# EAGLE design 09-09e (EAGLE 6.6.0)

## Sheet 1 of 2
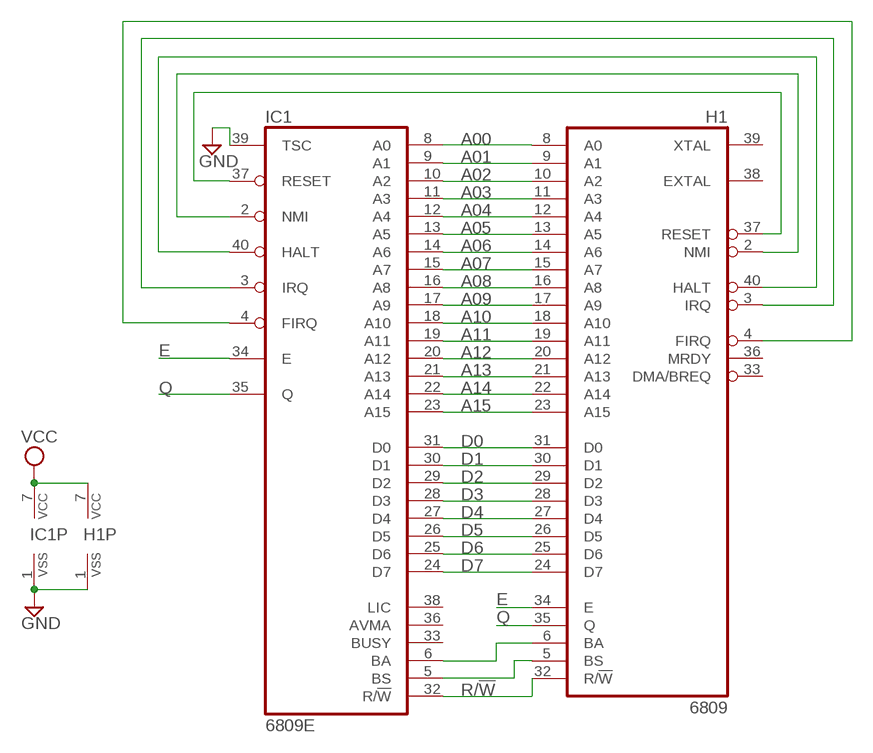
[diagram p0: schematic, sheet 1]

### Parts
H1  6809  [DIL40]
IC1  6809E  [DIL40]

### Nets
A00: H1.8(A0) IC1.8(A0)
A01: H1.9(A1) IC1.9(A1)
A02: H1.10(A2) IC1.10(A2)
A03: H1.11(A3) IC1.11(A3)
A04: H1.12(A4) IC1.12(A4)
A05: H1.13(A5) IC1.13(A5)
A06: H1.14(A6) IC1.14(A6)
A07: H1.15(A7) IC1.15(A7)
A08: H1.16(A8) IC1.16(A8)
A09: H1.17(A9) IC1.17(A9)
A10: H1.18(A10) IC1.18(A10)
A11: H1.19(A11) IC1.19(A11)
A12: H1.20(A12) IC1.20(A12)
A13: H1.21(A13) IC1.21(A13)
A14: H1.22(A14) IC1.22(A14)
A15: H1.23(A15) IC1.23(A15)
D0: H1.31(D0) IC1.31(D0)
D1: H1.30(D1) IC1.30(D1)
D2: H1.29(D2) IC1.29(D2)
D3: H1.28(D3) IC1.28(D3)
D4: H1.27(D4) IC1.27(D4)
D5: H1.26(D5) IC1.26(D5)
D6: H1.25(D6) IC1.25(D6)
D7: H1.24(D7) IC1.24(D7)
E: H1.34(E) IC1.34(E) ; also sheet 2
GND [Power]: H1.1(VSS) IC1.1(VSS) IC1.39(TSC) ; also sheet 2
N$1: H1.5(BS) IC1.5(BS)
N$4: H1.6(BA) IC1.6(BA)
N$5: H1.37(RESET) IC1.37(RESET)
N$6: H1.2(NMI) IC1.2(NMI)
N$8: H1.40(HALT) IC1.40(HALT)
N$9: H1.3(IRQ) IC1.3(IRQ)
N$10: H1.4(FIRQ) IC1.4(FIRQ)
Q: H1.35(Q) IC1.35(Q) ; also sheet 2
R/!W: H1.32(R/!W) IC1.32(R/!W)
VCC [Power]: H1.7(VCC) IC1.7(VCC) ; also sheet 2
Unconnected: H1.33(DMA/BREQ) H1.36(MRDY) H1.38(EXTAL) H1.39(XTAL) IC1.33(BUSY) IC1.36(AVMA) IC1.38(LIC)

## Sheet 2 of 2
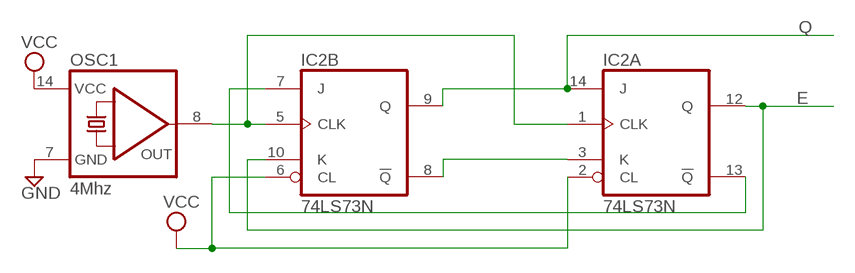
[diagram p1: schematic, sheet 2]

### Parts
IC2  74LS73N  [DIL14]
OSC1  4Mhz  QG5860  [DIL14S]

### Nets
E: IC2.10(B:K) IC2.12(A:Q) ; also sheet 1
GND [Power]: OSC1.7(GND) ; also sheet 1
N$2: IC2.1(A:CLK) IC2.5(B:CLK) OSC1.8(OUT)
N$3: IC2.3(A:K) IC2.8(B:!Q)
N$7: IC2.7(B:J) IC2.13(A:!Q)
Q: IC2.9(B:Q) IC2.14(A:J) ; also sheet 1
VCC [Power]: IC2.2(A:CL) IC2.6(B:CL) OSC1.14(VCC) ; also sheet 1

## Power pins joined to a net without a drawn wire
GND: IC2.11(P:GND)
VCC: IC2.4(P:VCC)

## Library data of the parts
H1 = micro-motorola:6809: MICROCONTROLLER/MEMORY DEVICE; MF: NTE ELECTRONICS; MPN: NTE6809; OC_FARNELL: 4530354; OC_NEWARK: 31C2459
IC1 = micro-motorola:6809E: MICROCONTROLLER/MEMORY DEVICE; MF: NTE ELECTRONICS; MPN: NTE6809E; OC_FARNELL: unknown; OC_NEWARK: 31C5318
IC2 = 74xx-us:74*73: Dual J-K FLIP FLOP, clear
OSC1 = crystal:QG5860: CRYSTAL RESONATOR; OC_FARNELL: unknown; OC_NEWARK: unknown

## Net classes
1 Power: width 0.508 mm, drill 0.254 mm, clearance 0.254 mm

## Board
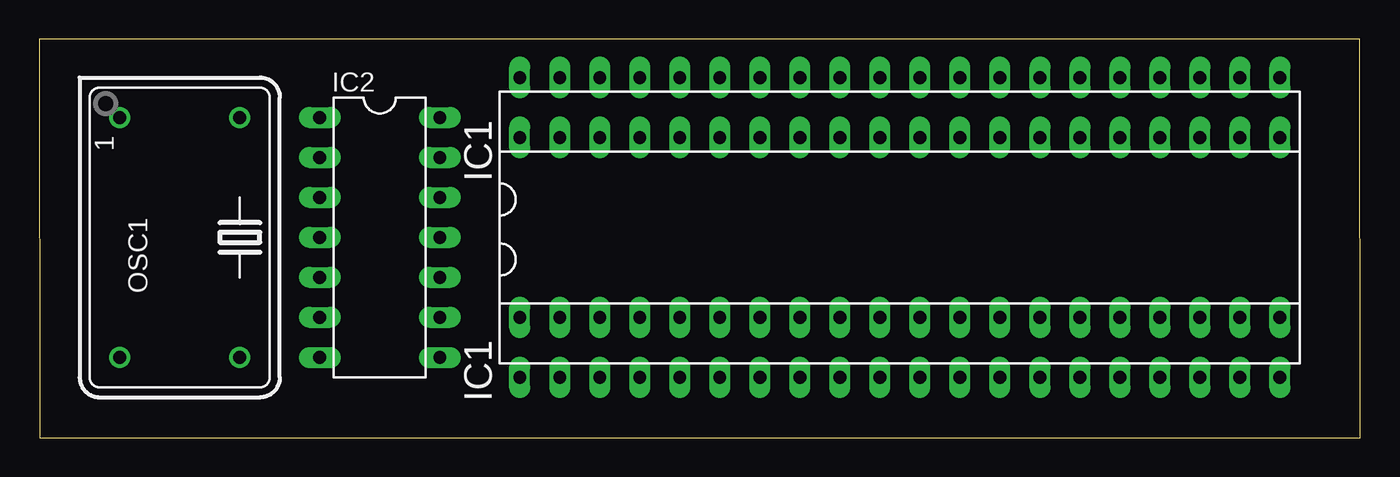
[diagram p2: board, top side]
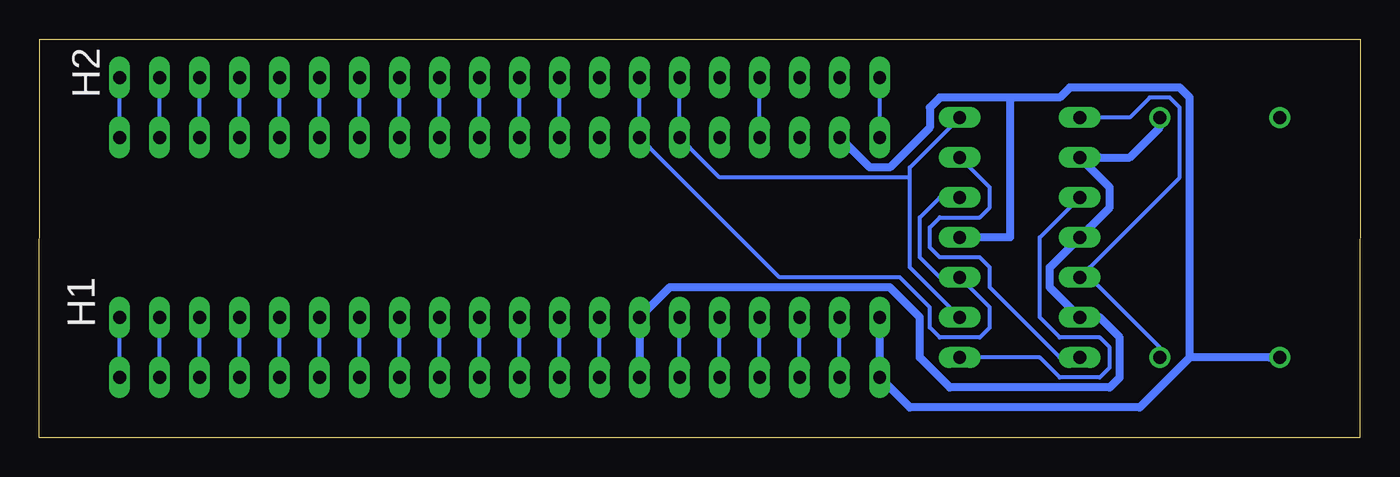
[diagram p3: board, bottom side, seen from below]

Size 83.85 x 25.3 mm. Coordinates in mm from the lower left corner, seen from the top.
Outline: 0.03,0 83.85,0 83.83,25.3 0,25.3 0.03,0
Copper layers (1*16): Top 0.035mm / dielectric 1.5mm / Bottom 0.035mm
Design rules "olimex10mil": minimum track width 10mil, minimum drill 24mil, track to track 10mil, track to pad 10mil, pad to pad 10mil, via to via 10mil, smd to smd 10mil, copper to edge 40mil, drill to drill 10mil, minimum pad ring 10mil, minimum via ring 8mil, stop-mask expansion 0mil, vias tented up to drill 0mil, thermal gap 10mil

### Footprints (pad centres in the part's own frame; a part is rotated, then mirrored left to right if it is on the bottom)
DIL40 = drill 0.813 long: 1 -24.13,-7.62; 2 -21.59,-7.62; 3 -19.05,-7.62; 4 -16.51,-7.62; 5 -13.97,-7.62; 6 -11.43,-7.62; 7 -8.89,-7.62; 8 -6.35,-7.62; 9 -3.81,-7.62; 10 -1.27,-7.62; 11 1.27,-7.62; 12 3.81,-7.62; 13 6.35,-7.62; 14 8.89,-7.62; 15 11.43,-7.62; 16 13.97,-7.62; 17 16.51,-7.62; 18 19.05,-7.62; 19 21.59,-7.62; 20 24.13,-7.62; 21 24.13,7.62; 22 21.59,7.62; 23 19.05,7.62; 24 16.51,7.62; 25 13.97,7.62; 26 11.43,7.62; 27 8.89,7.62; 28 6.35,7.62; 29 3.81,7.62; 30 1.27,7.62; 31 -1.27,7.62; 32 -3.81,7.62; 33 -6.35,7.62; 34 -8.89,7.62; 35 -11.43,7.62; 36 -13.97,7.62; 37 -16.51,7.62; 38 -19.05,7.62; 39 -21.59,7.62; 40 -24.13,7.62
DIL14 = drill 0.813 long: 1 -7.62,-3.81; 2 -5.08,-3.81; 3 -2.54,-3.81; 4 0,-3.81; 5 2.54,-3.81; 6 5.08,-3.81; 7 7.62,-3.81; 8 7.62,3.81; 9 5.08,3.81; 10 2.54,3.81; 11 0,3.81; 12 -2.54,3.81; 13 -5.08,3.81; 14 -7.62,3.81
DIL14S = drill 0.813: 1 -7.62,-3.81; 7 7.62,-3.81; 8 7.62,3.81; 14 -7.62,3.81

### Placement (x,y rotation side)
H1  54.63,15.25 0 top
IC1  54.63,11.44 0 top
IC2  21.61,12.71 270 top
OSC1  8.91,12.71 270 top

### Tracks (layer width: path | path; a pad name or v marks a point on that pad's centre or on a via)
A00
  Bottom 0.254: IC1.8 48.28,5.09 48.28,6.36 H1.8
A01
  Bottom 0.254: IC1.9 50.82,5.09 50.82,6.36 H1.9
A02
  Bottom 0.254: IC1.10 53.36,5.09 53.36,6.36 H1.10
A03
  Bottom 0.254: IC1.11 55.9,5.09 55.9,6.36 H1.11
A04
  Bottom 0.254: IC1.12 58.44,5.09 58.44,6.36 H1.12
A05
  Bottom 0.254: IC1.13 60.98,5.09 60.98,6.36 H1.13
A06
  Bottom 0.254: IC1.14 63.52,5.09 63.52,6.36 H1.14
A07
  Bottom 0.254: IC1.15 66.06,5.09 66.06,6.36 H1.15
A08
  Bottom 0.254: IC1.16 68.6,5.09 68.6,6.36 H1.16
A09
  Bottom 0.254: IC1.17 71.14,5.09 71.14,6.36 H1.17
A10
  Bottom 0.254: IC1.18 73.68,5.09 73.68,6.36 H1.18
A11
  Bottom 0.254: IC1.19 76.22,5.09 76.22,6.36 H1.19
A12
  Bottom 0.254: IC1.20 78.76,5.09 78.76,6.36 H1.20
A13
  Bottom 0.254: IC1.21 78.76,20.33 78.76,21.6 H1.21
A14
  Bottom 0.254: IC1.22 76.22,20.33 76.22,21.6 H1.22
A15
  Bottom 0.254: IC1.23 73.68,20.33 73.68,21.6 H1.23
D0
  Bottom 0.254: IC1.31 53.36,20.33 53.36,21.6 H1.31
D1
  Bottom 0.254: IC1.30 55.9,20.33 55.9,21.6 H1.30
D2
  Bottom 0.254: IC1.29 58.44,20.33 58.44,21.6 H1.29
D3
  Bottom 0.254: IC1.28 60.98,20.33 60.98,21.6 H1.28
D4
  Bottom 0.254: IC1.27 63.52,20.33 63.52,21.6 H1.27
D5
  Bottom 0.254: IC1.26 66.06,20.33 66.06,21.6 H1.26
D6
  Bottom 0.254: IC1.25 68.6,20.33 68.6,21.6 H1.25
D7
  Bottom 0.254: IC1.24 71.14,20.33 71.14,21.6 H1.24
E
  Bottom 0.254: H1.34 45.74,21.6 45.74,20.33 IC1.34 45.11,18.43 36.85,10.17 29.23,10.17 27.33,8.27 27.33,7 26.69,6.36 24.15,6.36 23.52,7 23.52,8.27 24.79,9.54 IC2.10 | IC2.10 26.69,10.17 | 26.69,10.17 27.96,11.44 27.96,13.98 26.69,15.25 IC2.12 | IC2.10 26.69,10.17
GND
  Bottom 0.508: 10.82,5.09 5.74,5.09 OSC1.7 | 10.82,5.09 13.99,1.92 28.6,1.92 29.87,3.19 IC1.1 30.5,5.09 30.5,6.36 H1.1 | 10.82,5.09 10.82,21.6 11.45,22.24 18.44,22.24 19.07,21.6 22.25,21.6 | 22.25,21.6 26.69,21.6 27.33,20.97 27.33,19.7 29.87,17.16 31.14,17.16 32.41,18.43 IC1.39 | 22.25,21.6 22.22,12.71 24.35,12.71 IC2.11
N$1
  Bottom 0.254: IC1.5 40.66,5.09 40.66,6.36 H1.5
N$2
  Bottom 0.254: OSC1.8 12.72,5.73 17.17,10.17 IC2.5 17.17,10.81 11.45,16.52 11.45,20.97 12.09,21.6 13.36,21.6 14.63,20.33 16.53,20.33 IC2.1
N$3
  Bottom 0.254: IC2.8 24.15,5.09 20.34,5.09 19.07,3.82 16.53,3.82 15.9,4.46 15.9,5.73 16.53,6.36 19.07,6.36 20.34,7.63 20.34,12.71 18.44,14.62 IC2.3
N$4
  Bottom 0.254: IC1.6 43.2,5.09 43.2,6.36 H1.6
N$5
  Bottom 0.254: IC1.37 38.12,20.33 38.12,21.6 H1.37
N$6
  Bottom 0.254: IC1.2 33.04,5.09 33.04,6.36 H1.2
N$7
  Bottom 0.254: IC2.7 19.07,5.09 23.52,9.54 23.52,10.81 24.15,11.44 26.69,11.44 27.33,12.08 27.33,13.35 26.69,13.98 24.15,13.98 23.52,14.62 23.52,15.89 24.79,17.16 IC2.13
N$8
  Bottom 0.254: IC1.40 30.5,20.33 30.5,21.6 H1.40
N$9
  Bottom 0.254: IC1.3 35.58,5.09 35.58,6.36 H1.3
N$10
  Bottom 0.254: IC1.4 38.12,5.09 38.12,6.36 H1.4
Q
  Bottom 0.254: H1.35 43.2,21.6 43.2,20.33 IC1.35 42.57,18.43 40.66,16.52 28.6,16.52 | 28.6,16.52 28.6,17.16 26.06,19.7 IC2.14 | 28.6,16.52 28.6,10.81 26.06,8.27 IC2.9
R/!W
  Bottom 0.254: IC1.32 50.82,20.33 50.82,21.6 H1.32
VCC
  Bottom 0.508: OSC1.14 12.72,19.7 14.63,17.79 16.53,17.79 IC2.2 17.17,17.16 15.9,15.89 15.9,14.62 17.17,13.35 IC2.4 18.44,12.08 19.71,10.81 19.71,9.54 18.44,8.27 IC2.6 16.53,7.63 15.26,6.36 15.26,3.82 15.9,3.19 26.06,3.19 27.96,5.09 27.96,7.63 29.87,9.54 43.84,9.54 45.11,8.27 H1.7 45.74,6.36 45.74,5.09 IC1.7

### Text on the board
bPlace: H2